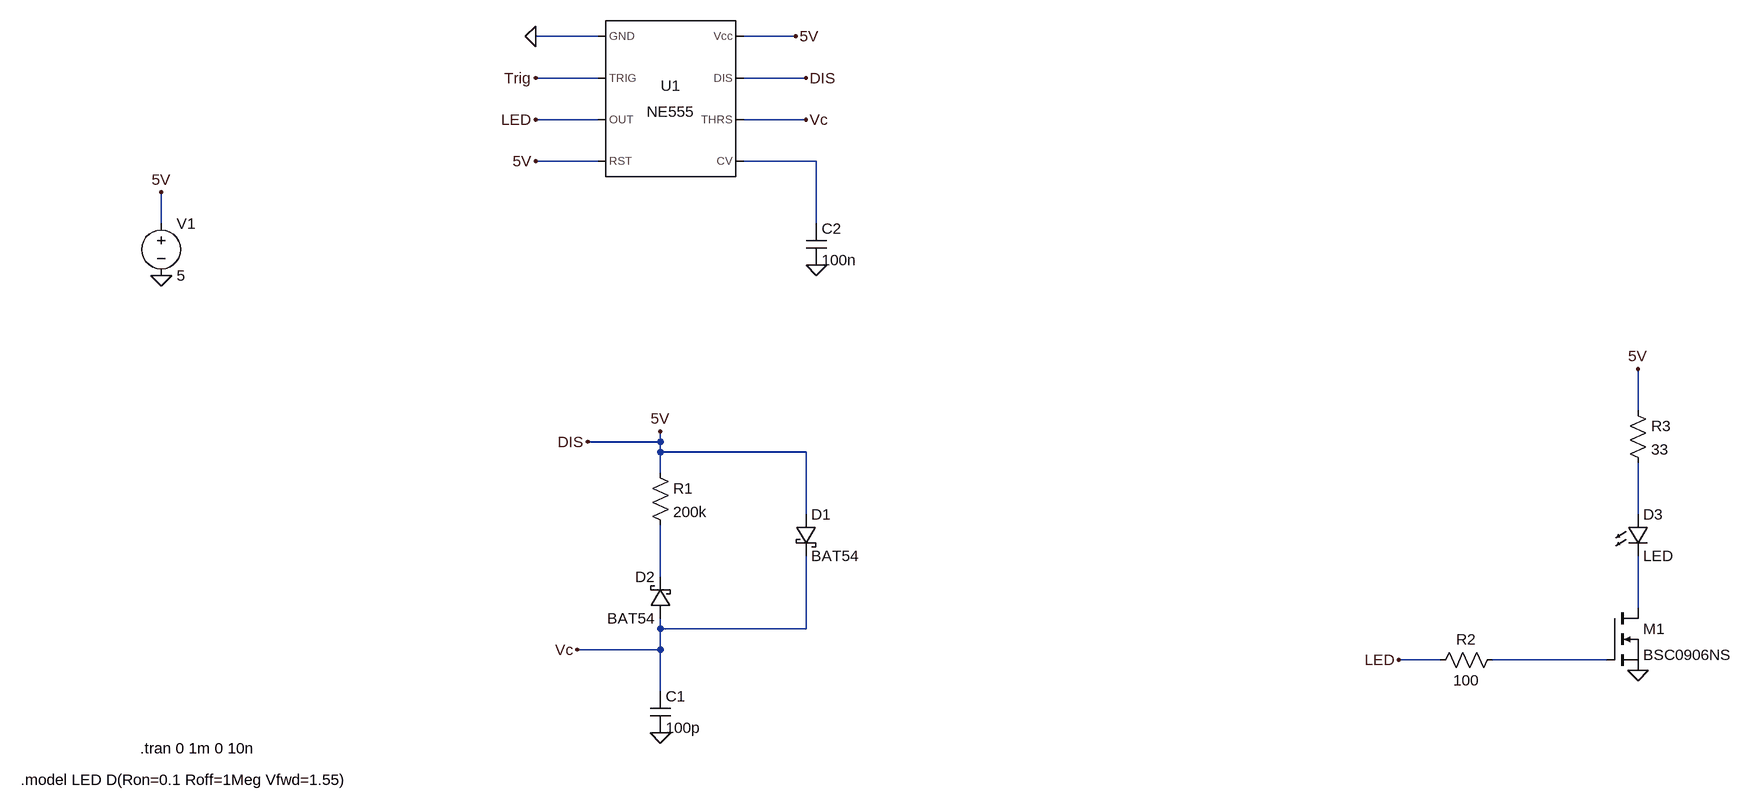
[diagram p0: schematic Draft4.asc]
Draft4.asc, the LTspice schematic file:
Version 4
SHEET 1 1844 1224
WIRE 96 64 0 64
WIRE 400 64 320 64
WIRE 96 128 0 128
WIRE 416 128 320 128
WIRE 96 192 0 192
WIRE 416 192 320 192
WIRE 96 256 0 256
WIRE 432 256 320 256
WIRE -576 352 -576 304
WIRE 432 352 432 256
WIRE 1696 640 1696 576
WIRE 192 688 192 672
WIRE 192 688 80 688
WIRE 192 704 192 688
WIRE 416 704 192 704
WIRE 192 736 192 704
WIRE 416 800 416 704
WIRE 1696 800 1696 720
WIRE 192 896 192 816
WIRE 1696 944 1696 864
WIRE 192 976 192 960
WIRE 416 976 416 864
WIRE 416 976 192 976
WIRE 192 1008 192 976
WIRE 192 1008 64 1008
WIRE 1392 1024 1328 1024
WIRE 1648 1024 1472 1024
WIRE 192 1072 192 1008
FLAG 400 64 5V
FLAG 416 128 DIS
FLAG 416 192 Vc
FLAG 0 64 0
FLAG 0 192 LED
FLAG 0 128 Trig
FLAG 0 256 5V
FLAG 432 416 0
FLAG -576 432 0
FLAG -576 304 5V
FLAG 64 1008 Vc
FLAG 192 1136 0
FLAG 192 672 5V
FLAG 80 688 DIS
FLAG 1328 1024 LED
FLAG 1696 1040 0
FLAG 1696 576 5V
SYMBOL Misc\\NE555 208 160 R0
SYMATTR InstName U1
SYMBOL cap 416 352 R0
SYMATTR InstName C2
SYMATTR Value 100n
SYMBOL voltage -576 336 R0
SYMATTR InstName V1
SYMATTR Value 5
SYMBOL schottky 208 960 R180
WINDOW 0 24 64 Left 2
WINDOW 3 24 0 Left 2
SYMATTR InstName D2
SYMATTR Value BAT54
SYMBOL cap 176 1072 R0
SYMATTR InstName C1
SYMATTR Value 100p
SYMBOL schottky 400 800 R0
SYMATTR InstName D1
SYMATTR Value BAT54
SYMBOL res 176 720 R0
SYMATTR InstName R1
SYMATTR Value 200k
SYMBOL res 1488 1008 R90
WINDOW 0 0 56 VBottom 2
WINDOW 3 32 56 VTop 2
SYMATTR InstName R2
SYMATTR Value 100
SYMBOL nmos 1648 944 R0
SYMATTR InstName M1
SYMATTR Value BSC0906NS
SYMBOL LED 1680 800 R0
SYMATTR InstName D3
SYMATTR Value LED
SYMBOL res 1680 624 R0
SYMATTR InstName R3
SYMATTR Value 33
TEXT -608 1160 Left 2 !.tran 0 1m 0 10n
TEXT -792 1208 Left 2 !.model LED D(Ron=0.1 Roff=1Meg Vfwd=1.55)

The netlist it stands for:
* Draft4.asc
XU1 0 Trig LED DIS N001 Vc DIS DIS NE555  ; pins GND TRIG OUT RST CV THRS DIS Vcc
C2 N001 0 100n
V1 DIS 0 5
D2 Vc N003 BAT54
C1 Vc 0 100p
D1 DIS Vc BAT54
R1 DIS N003 200k
R2 N005 LED 100
M1 N004 N005 0 0 BSC0906NS
D3 N002 N004 LED
R3 DIS N002 33
.model D D
.lib standard.dio
.model NMOS NMOS
.model PMOS PMOS
.lib standard.mos
.tran 0 1m 0 10n
.model LED D(Ron=0.1 Roff=1Meg Vfwd=1.55)
.lib NE555.sub
.backanno
.end